# Altium schematic sheet Misc.SchDoc: Bernardo
size A3; Date: 14/11/2018; DrawnBy: Wim Van Gool; Revision: 01; SheetNumber: 4; SheetTotal: 7
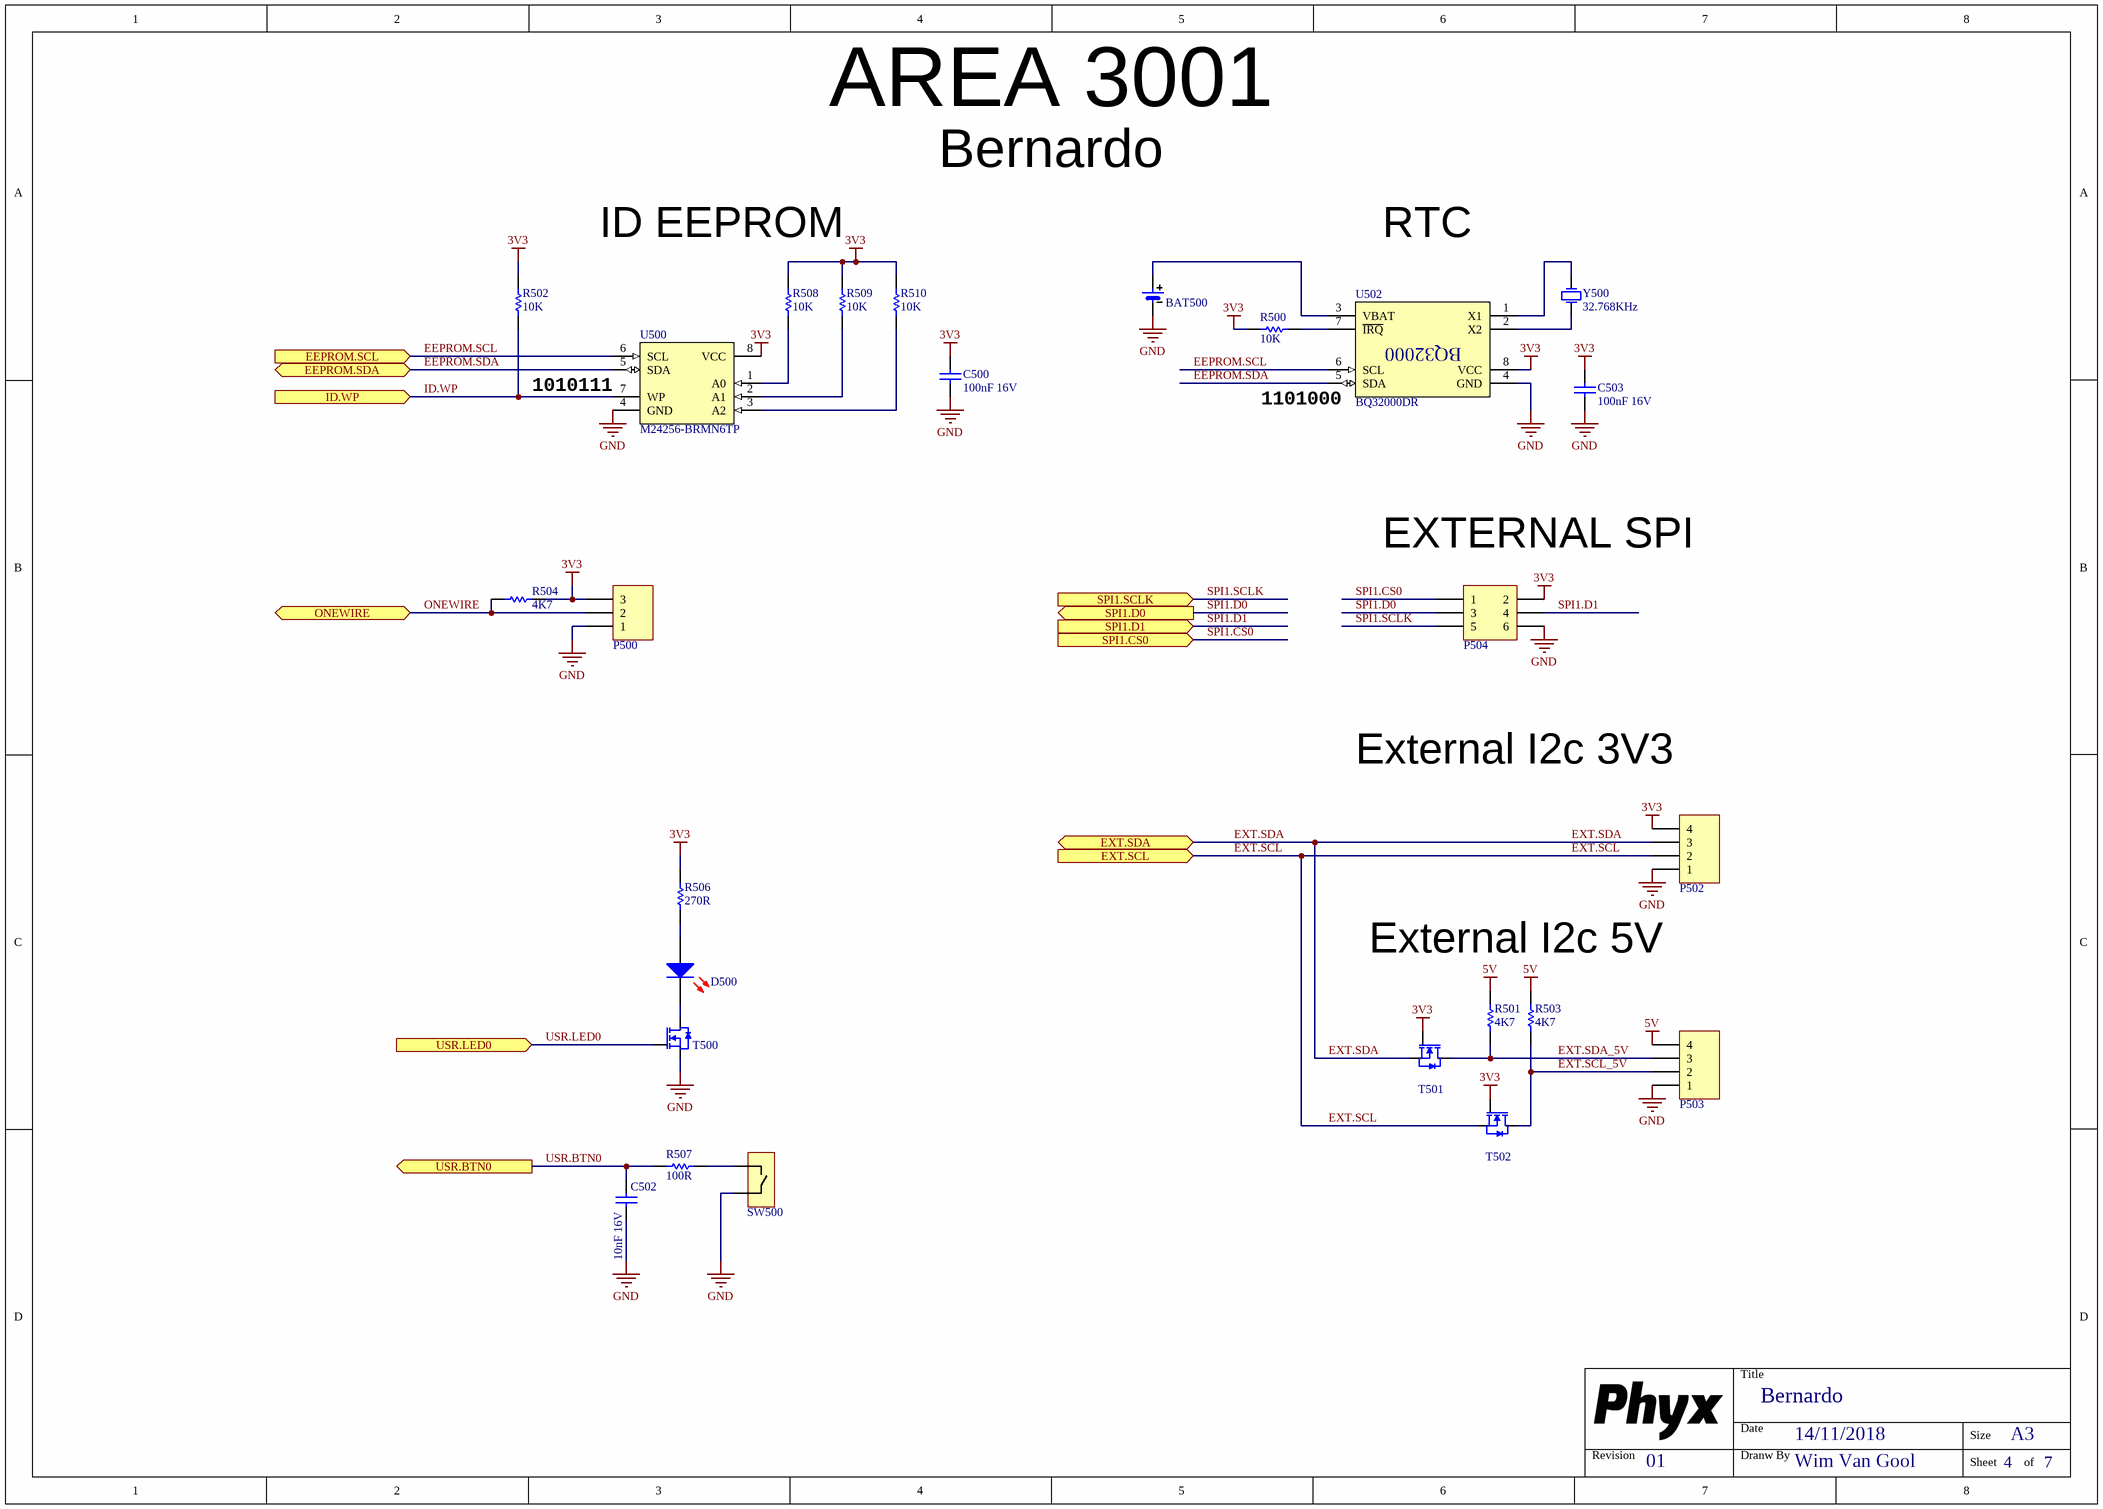
[diagram p0: Misc.SchDoc]

## Parts
BAT500  BR-1220/HFN 35mAh  [BR-1220_HFN]  (value not drawn)
C500  value 100nF 16V  [C0603_N]  (hidden comment: CAP_CERAMIC)
C502  value 10nF 16V  [C0603_N]  (hidden comment: CAP_CERAMIC)
C503  value 100nF 16V  [C0603_N]  (hidden comment: CAP_CERAMIC)
D500  Default 0805 Red LED  [LED_0805_RD]  (value not drawn)
P500  Header 3  [HDR1X3]  (value not drawn)
P502  Header 4  [HDR1X4]  (value not drawn)
P503  Header 4  [HDR1X4]  (value not drawn)
P504  Header 3X2  [HDR2X3]  (value not drawn)
R500  value 10K  [R0603_N]  (hidden comment: RESISTOR)
R501  value 4K7  [R0603_N]  (hidden comment: RESISTOR)
R502  value 10K  [R0603_N]  (hidden comment: RESISTOR)
R503  value 4K7  [R0603_N]  (hidden comment: RESISTOR)
R504  value 4K7  [R0603_N]  (hidden comment: RESISTOR)
R506  value 270R  [R0603_N]  (hidden comment: RESISTOR)
R507  value 100R  [R0603_N]  (hidden comment: RESISTOR)
R508  value 10K  [R0603_N]  (hidden comment: RESISTOR)
R509  value 10K  [R0603_N]  (hidden comment: RESISTOR)
R510  value 10K  [R0603_N]  (hidden comment: RESISTOR)
SW500  Default TH TACT  [TACTSW]  (value not drawn)
T500  0.2A N-Ch MOSFET Vgs 3.2  [SOT23-3]  (value not drawn)
T501  0.2A N-Ch MOSFET Vgs 3.2  [SOT23-3]  (value not drawn)
T502  0.2A N-Ch MOSFET Vgs 3.2  [SOT23-3]  (value not drawn)
U500  value M24256-BRMN6TP  [SOIC_N_8]  (hidden comment: Serial EEPROM 256Kb (8b) I2C)
U502  value BQ32000DR  [SOIC_N_8]  (hidden comment: I2C RTC Ti BQ32000)
Y500  value 32.768KHz  [CMR200T]  (hidden comment: 32.768Khz CMR200 12.5pF)

## Ports
EEPROM.SCL (in), EEPROM.SDA (bidir), EXT.SCL (in), EXT.SDA (bidir), ID.WP (in), ONEWIRE (bidir), SPI1.CS0 (in), SPI1.D0 (out), SPI1.D1 (in), SPI1.SCLK (in), USR.BTN0 (out), USR.LED0 (in)

## Nets
3V3: C500.1 C503.1 P500.3 P502.4 P504.2 R500.1 R502.1 R504.2 R506.1 R508.1 R509.1 R510.1 T501.1(G) T502.1(G) U500.8(VCC) U502.8(VCC)
5V: P503.4 R501.1 R503.1
GND: BAT500.2 C500.2 C502.2 C503.2 P500.1 P502.1 P503.1 P504.6 SW500.2 T500.2(S) U500.4(GND) U502.4(GND)
EEPROM.SCL: U500.6(SCL) U502.6(SCL) ; port EEPROM.SCL
EEPROM.SDA: U500.5(SDA) U502.5(SDA) ; port EEPROM.SDA
EXT.SCL: P502.2 T502.2(S) ; port EXT.SCL
EXT.SCL_5V: P503.2 R503.2 T502.3(D)
EXT.SDA: P502.3 T501.2(S) ; port EXT.SDA
EXT.SDA_5V: P503.3 R501.2 T501.3(D)
ID.WP: R502.2 U500.7(WP) ; port ID.WP
ONEWIRE: P500.2 R504.1 ; port ONEWIRE
SPI1.CS0: P504.1 ; port SPI1.CS0
SPI1.D0: P504.3 ; port SPI1.D0
SPI1.D1: P504.4 ; port SPI1.D1
SPI1.SCLK: P504.5 ; port SPI1.SCLK
USR.BTN0: C502.1 R507.2 ; port USR.BTN0
USR.LED0: T500.1(G) ; port USR.LED0
NetBAT500_1: BAT500.1 U502.3(VBAT)
NetD500_1: D500.1(A) R506.2
NetD500_2: D500.2(K) T500.3(D)
NetR500_2: R500.2 U502.7(~{IRQ})
NetR507_1: R507.1 SW500.1
NetR508_2: R508.2 U500.1(A0)
NetR509_2: R509.2 U500.2(A1)
NetR510_2: R510.2 U500.3(A2)
NetU502_1: U502.1(X1) Y500.2(OSC2)
NetU502_2: U502.2(X2) Y500.1(OSC1)

## Notes on the sheet
- AREA 3001
- Bernardo
- ID EEPROM
- RTC
- 1010111
- (near U502) 1101000
- (near P504) EXTERNAL SPI
- External I2c 3V3
- External I2c 5V
- Title
- Revision
- Date
- Dranw By
- Size
- A3
- Sheet
- of

## Library data of the parts
BAT500 = BAT BR-1220/HFN: =Description; Value: 1220; Supplier 1: Farnell; Supplier Part Number 1: 1892653
C500 C503 = CAP # 100nF 16V 0603: Capacitor Ceramic
C502 = CAP # 10nF 16V 0603: Capacitor Ceramic
D500 = LED # Red 0805: =Description; Supplier 1: Farnell; Supplier Part Number 1: 2099236
P500 = Pin Header 2.54mm 3way
P502 P503 = Pin Header 2.54mm 4way
P504 = Pin Header 2.54mm dual row 6way
R500 R502 R508-R510 = RES # 10K 0603: Supplier 1: Farnell; Supplier Part Number 1: 2502397
R501 R503 R504 = RES # 4K7 0603
R506 = RES # 270R 0603: Supplier 1: Farnell; Supplier Part Number 1: 2497841
R507 = RES # 100R 0603
SW500 = SW TACT
T500-T502 = BSS138 N-Ch MOSFET 0.2A 3.2Vgs 60Vds: Value: BSS138; Supplier 1: Farnell; Supplier Part Number 1: 2432717
U500 = EEPROM # I2C 32KKx8b M24256-BRMN6TP: =Description; Supplier 1: Digikey; Supplier Part Number 1: 497-6348-1-ND
U502 = RTC # BQ32000: =Description; Supplier 1: Farnell; Supplier Part Number 1: 1754773
Y500 = XTAL # 32.768Khz 12.5pF CMR200: Crystal Oscillator; Supplier 1: Farnell; Supplier Part Number 1: 2101359